# EAGLE design main (EAGLE 9.4.2)
Assembly variants: Main
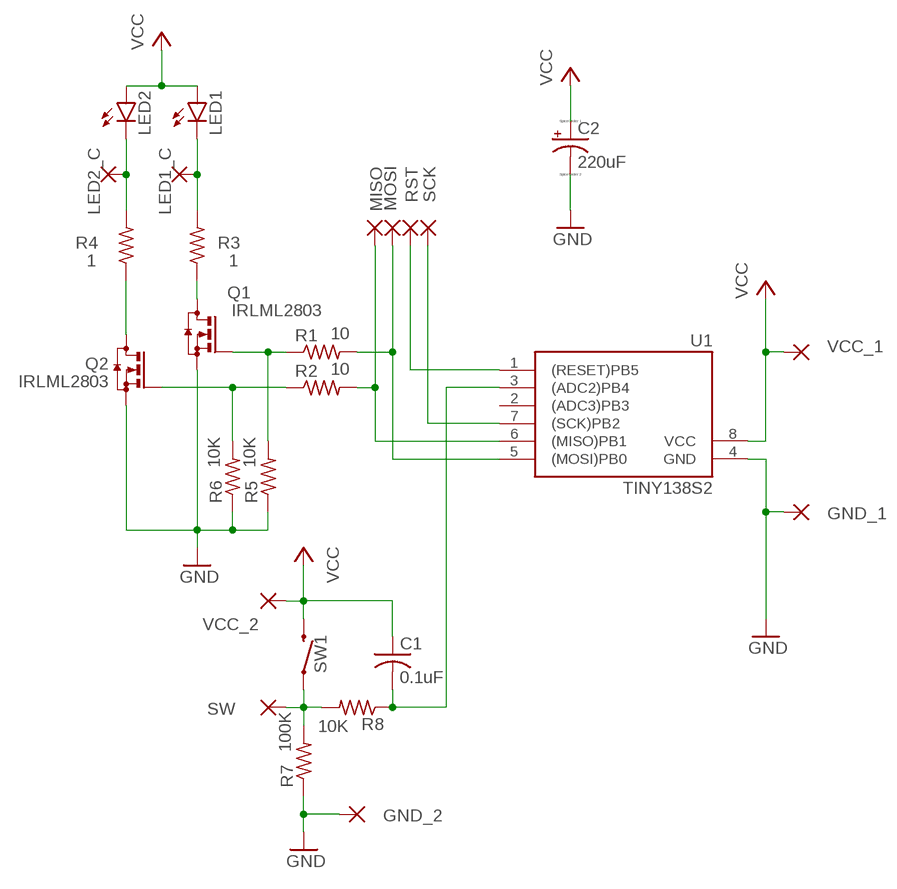
[diagram p0: schematic, sheet 1]

## Parts
C1  0.1uF  C-USC0805  [C0805]
C2  220uF  CPOL-USE2,5-6E  [E2,5-6E]
GND_1  1,6/0,9  [1,6/0,9]
GND_2  1,6/0,9  [1,6/0,9]
LED1  Z-POWER-LED  [Z-POWER-LED-PCB-TYPE]  (not fitted in variant Main)
LED1_C  1,6/0,9  [1,6/0,9]
LED2  Z-POWER-LED  [Z-POWER-LED-PCB-TYPE]  (not fitted in variant Main)
LED2_C  1,6/0,9  [1,6/0,9]
MISO  1,6/0,9  [1,6/0,9]
MOSI  1,6/0,9  [1,6/0,9]
Q1  IRLML2803  [SOT23]
Q2  IRLML2803  [SOT23]
R1  10  R-US_R0805  [R0805]
R2  10  R-US_R0805  [R0805]
R3  1  R-US_0309/10  [0309/10]
R4  1  R-US_0309/10  [0309/10]
R5  10K  R-US_R0805  [R0805]
R6  10K  R-US_R0805  [R0805]
R7  100K  R-US_R0805  [R0805]
R8  10K  R-US_R0805  [R0805]
RST  1,6/0,9  [1,6/0,9]
SCK  1,6/0,9  [1,6/0,9]
SW  1,6/0,9  [1,6/0,9]
SW1  MOMENTARY-SWITCH-SPST-PTH-6.0MM  [TACTILE_SWITCH_PTH_6.0MM]  (not fitted in variant Main)
U1  TINY138S2  [SO08]
VCC_1  1,6/0,9  [1,6/0,9]
VCC_2  1,6/0,9  [1,6/0,9]

## Nets
GND: C2.- GND_1.1(P) GND_2.1(P) Q1.2(S) Q2.2(S) R5.1 R6.1 R7.1 U1.4(GND)
LED1_C: LED1.C LED1_C.1(P) R3.2
LED2_C: LED2.C LED2_C.1(P) R4.2
MISO: MISO.1(P) R2.2 U1.6((MISO)PB1)
MOSI: MOSI.1(P) R1.2 U1.5((MOSI)PB0)
PB4: C1.2 R8.1 U1.3((ADC2)PB4)
Q1_D: Q1.3(D) R3.1
Q1_G: Q1.1(G) R1.1 R5.2
Q2_D: Q2.3(D) R4.1
Q2_G: Q2.1(G) R2.1 R6.2
RESET: RST.1(P) U1.1((RESET)PB5)
SCK: SCK.1(P) U1.7((SCK)PB2)
SW1: R7.2 R8.2 SW1.1 SW.1(P)
VCC: C1.1 C2.+ LED1.A LED2.A SW1.3 U1.8(VCC) VCC_1.1(P) VCC_2.1(P)
Unconnected: U1.2((ADC3)PB3)

## Library data of the parts
C1 = resistor:C-US: CAPACITOR, American symbol
C2 = resistor:CPOL-US: POLARIZED CAPACITOR, American symbol
GND_1 GND_2 LED1_C LED2_C MISO MOSI RST SCK SW VCC_1 VCC_2 = wirepad:1,6/0,9: THROUGH-HOLE PAD
LED1 LED2 = led:Z-POWER-LED: Z-Power LED Source: http://www.seoulsemicon.co.kr .. X42182.pdf
Q1 Q2 = ashep:IRLML2803: N-CHANNEL MOSFET
R1-R8 = resistor:R-US_: RESISTOR, American symbol
SW1 = SparkFun-Switches:MOMENTARY-SWITCH-SPST: Momentary Switch (Pushbutton) - SPST Normally-open (NO) SPST momentary switches (buttons, pushbuttons). Variants PTH-12MM - 12mm square, through-hole Momentary Pushbutton Switch - 12mm Square <https://www.sparkfun.com/products/9190> (COM-09190) PTH-6.0MM, PTH-6.0MM-KIT - 6.0mm square, through-hole Mini Pushbutton Switch <https://www.sparkfun.com/products/97> (COM-00097) KIT package intended for soldering kit's - only one side of pads' copper is exposed. PTH-RIGHT-ANGLE-KIT - Right-angle, through-hole Right Angle Tactile Button <https://www.sparkfun.com/products/10791> - Used on SparkFun BigTime Watch Kit <https://www.sparkfun.com/products/11734> SMD-12MM - 12mm square, surface-mount Tactile Button - SMD (12mm) <https://www.sparkfun.com/products/12993> (COM-12993) Used on SparkFun PicoBoard <https://www.sparkfun.com/products/11888> SMD-4.5MM - 4.5mm Square Trackball Switch Used on SparkFun Blackberry Trackballer Breakout <https://www.sparkfun.com/products/13169> SMD-4.6MMX2.8MM - 4.60mm x 2.80mm, surface mount Used on SparkFun SAMD21 Mini Breakout <https://www.sparkfun.com/products/13664> SMD-5.2MM, SMD-5.2-REDUNDANT - 5.2mm square, surface-mount Mini Pushbutton Switch - SMD <https://www.sparkfun.com/products/8720> (COM-08720) Used on Arduino Pro Mini <https://www.sparkfun.com/products/11114> REDUNDANT package connects both switch circuits together SMD-6.0X3.5MM - 6.0 x 3.5mm, surface mount Momentary Reset Switch SMD <https://www.sparkfun.com/products/8229> (COM-08229) SMD-6.2MM-TALL - 6.2mm square, surface mount Tactile Button - SMD (6mm) <https://www.sparkfun.com/products/12992> Used on SparkFun Digital Sandbox <https://www.sparkfun.com/products/12651> SMD-RIGHT-ANGLE - Right-angle, surface mount Used on SparkFun Block for Intel® Edison - Arduino <https://www.sparkfun.com/products/13036>; PROD_ID: SWCH-08441; SF_SKU: COM-00097
U1 = avr-7:TINY13*

## Board
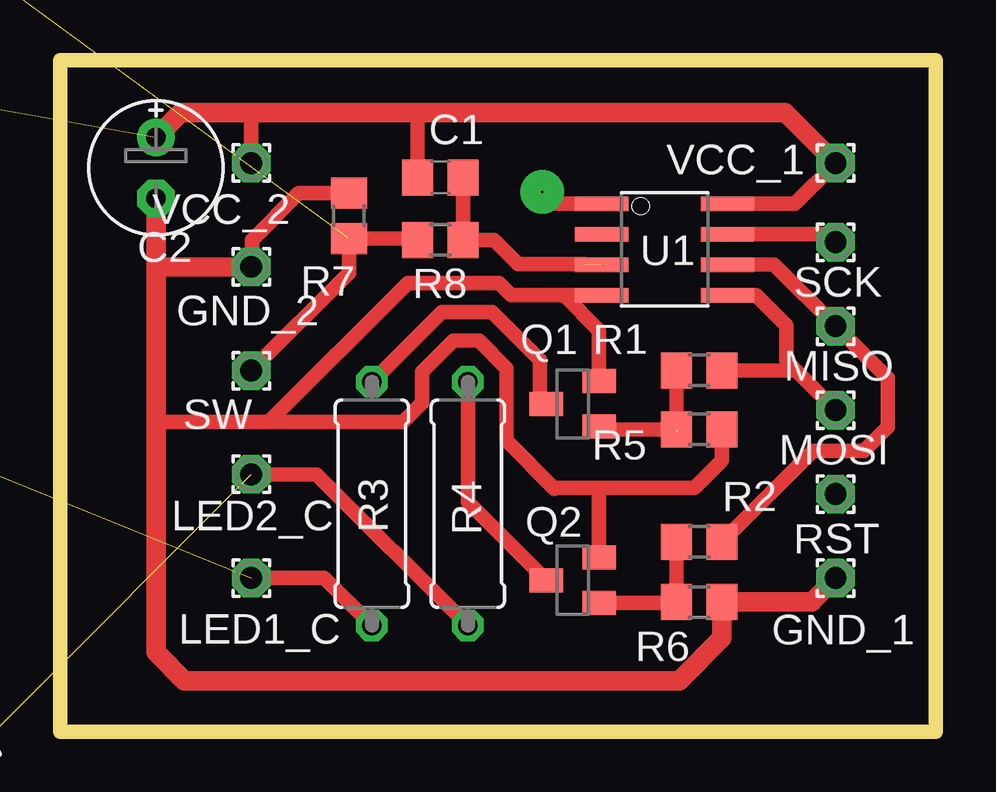
[diagram p1: board, top side]
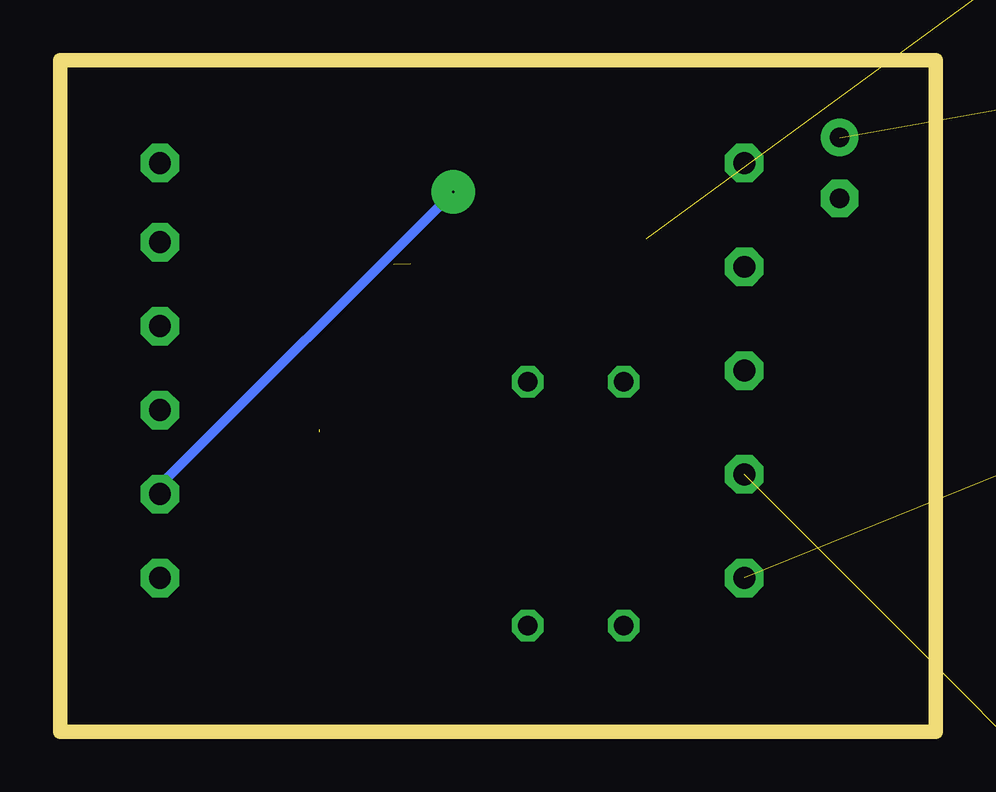
[diagram p2: board, bottom side, seen from below]

Size 36.5 x 28 mm. Coordinates in mm from the lower left corner, seen from the top.
Outline: 36.5,28 36.5,0 0,0 0,28 36.5,28
Copper layers (1*16): Top 0.035mm / dielectric 1.5mm / Bottom 0.035mm
Design rules "default": minimum track width 6mil, minimum drill 0.35mm, track to track 6mil, track to pad 6mil, pad to pad 6mil, via to via 6mil, smd to smd 6mil, copper to edge 40mil, drill to drill 6mil, minimum pad ring 10mil, minimum via ring 8mil, stop-mask expansion 4mil, vias tented up to drill 0mil, thermal gap 10mil

### Footprints (pad centres in the part's own frame; a part is rotated, then mirrored left to right if it is on the bottom)
C0805 = smd 1.3 x 1.5: 1 -0.95,0; 2 0.95,0
E2,5-6E = drill 0.813 pad 1.575: + -1.27,0 | drill 0.813 pad 1.575 octagon: - 1.27,0
1,6/0,9 = drill 0.914 pad 1.6 octagon: 1 0,0
Z-POWER-LED-PCB-TYPE = smd 3.3 x 2.1: A -6.65,-1.12; C 6.65,1.12
SOT23 = smd 1 x 1.4: 1 -0.95,-1.1; 2 0.95,-1.1; 3 0,1.1
R0805 = smd 1.3 x 1.5: 1 -0.95,0; 2 0.95,0
0309/10 = drill 0.813 octagon: 1 -5.08,0; 2 5.08,0
TACTILE_SWITCH_PTH_6.0MM = drill 1.016 pad 1.88: 1 -3.251,2.261; 2 3.251,2.261; 3 -3.251,-2.261; 4 3.251,-2.261
SO08 = smd 0.61 x 2.21: 1 -1.905,-2.616; 2 -0.635,-2.616; 3 0.635,-2.616; 4 1.905,-2.616; 5 1.905,2.616; 6 0.635,2.616; 7 -0.635,2.616; 8 -1.905,2.616

### Placement (x,y rotation side)
C1  15.85,23.1 0 top
C2  4,23.5 270 top
GND_1  32.33,6.4 0 top
GND_2  7.98,19.37 0 top
LED1  -14,21.5 270 top  (outside the outline)
LED1_C  7.98,6.4 0 top
LED2  -13,-2.5 270 top  (outside the outline)
LED2_C  7.98,10.72 0 top
MISO  32.33,16.9 0 top
MOSI  32.33,13.4 0 top
Q1  21.37,13.66 90 top
Q2  21.37,6.31 90 top
R1  26.64,15.06 0 top
R2  26.64,7.91 0 top
R3  13,9.5 270 top
R4  17,9.5 270 top
R5  26.64,12.6 180 top
R6  26.64,5.4 180 top
R7  12.05,21.5 270 top
R8  15.85,20.5 180 top
RST  32.33,9.9 0 top
SCK  32.33,20.4 0 top
SW  7.98,15.05 0 top
SW1  -14,39.5 180 top  (outside the outline)
U1  25.2,20.1 270 top
VCC_1  32.33,23.7 0 top
VCC_2  7.98,23.7 0 top

### Tracks (layer width: path | path; a pad name or v marks a point on that pad's centre or on a via)
GND
  Top 0.2: R5.1 | 27.69,5.5 R6.1
  Top 0.406: 27.79,5.4 27.69,5.5
  Top 0.61: GND_2.1 8,19.4 8,20.5 9.95,22.45 R7.1 | R6.1 | R5.1 27.59,11.29 26.45,10.15 22.5,10.15 | 22.5,10.15 20.65,10.15 20.62,10.12 18.62,12.12 18.62,15.14 17.46,16.3 16.4,16.3 15.1,15 15.1,13.7 14.3,12.9 8.7,12.9 | Q2.2 22.47,10.12 22.5,10.15 | 8.7,12.9 14.5,18.7 18.3,18.7 18.8,18.2 21,18.2 | 21,18.2 U1.4 | Q1.2 22.47,16.72 21,18.2 | 4,13 4.1,12.9 8.7,12.9 | 4.12,19.38 4,19.5
  Top 0.813: R6.1 27.6,3.9 25.82,2.12 5.18,2.12 4,3.3 4,13 4,19.5 C2.- | R6.1 31.33,5.4 GND_1.1 | GND_2.1 4.12,19.38
LED1_C  (1 unrouted)
  Top 0.61: LED1_C.1 11.02,6.4 R3.2
LED2_C  (1 unrouted)
  Top 0.61: LED2_C.1 10.7,10.73 R4.2
MISO
  Top 0.61: U1.6 29.77,19.46 MISO.1 34.5,14.73 34.5,12.7 33.5,11.7 31.38,11.7 R2.2
MOSI
  Top 0.406: 27.82,15.28 R1.2
  Top 0.61: 30.68,15.06 30.28,15.46 30.28,16.92 29.01,18.2 U1.5 | MOSI.1 31.12,14.62 30.68,15.06 | R1.2 30.68,15.06
PB4  (1 unrouted)
  Top 0.61: 21.88,19.5 19.1,19.5 18.1,20.5 R8.1 C1.2
Q1_D
  Top 0.406: 20.27,13.64 Q1.3 20,13.93
  Top 0.61: R3.1 15.92,17.5 18,17.5 20,15.5 20,13.93
Q1_G  (1 unrouted)
  Top 0.2: 22.63,12.71 Q1.1
  Top 0.61: R1.1 25.69,12.5 | R5.2 22.58,12.6 Q1.1
Q2_D
  Top 0.61: Q2.3 17,9.58 R4.1
Q2_G
  Top 0.2: R6.2 25.65,5.36
  Top 0.61: 25.65,5.36 Q2.1 | R2.1 R6.2
RESET  (via drill 0.1 pad 1.8)
  Top 0.406: 20.59,22.01 v20.1,22.5
  Top 0.61: U1.1 20.59,22.01
  Bottom 0.406: RST.1 32.33,10.27 v20.1,22.5
SCK
  Top 0.406: 32,20.73 SCK.1
  Top 0.61: U1.7 32,20.73
SW1  (1 unrouted)
  Top 0.2: 14.85,20.55 R8.2
  Top 0.61: 14.85,20.55 R7.2 12.05,19.12 SW.1
VCC  (3 unrouted)
  Top 0.2: 14.9,25.7 15,25.8
  Top 0.61: 14.9,25.7 C1.1 | U1.8 30.64,22.01 VCC_1.1 | VCC_2.1 7.98,25.77 8,25.8
  Top 0.813: VCC_1.1 30.23,25.8 15,25.8 8,25.8 5.03,25.8 C2.+